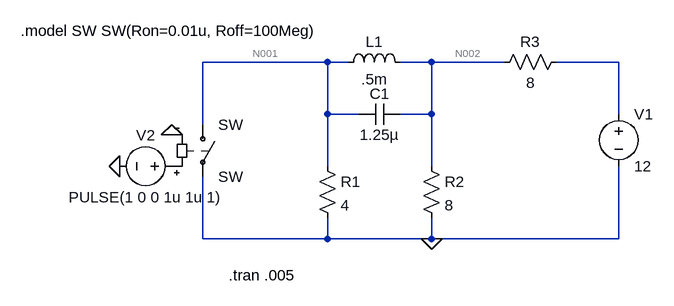
[diagram p0: schematic pas75.asc]
pas75.asc, the LTspice schematic file:
Version 4.1
SHEET 1 880 680
WIRE 32 32 -160 32
WIRE 64 32 32 32
WIRE 192 32 144 32
WIRE 304 32 192 32
WIRE 480 32 384 32
WIRE 32 112 32 32
WIRE 80 112 32 112
WIRE 192 112 192 32
WIRE 192 112 144 112
WIRE 480 112 480 32
WIRE -160 128 -160 32
WIRE 32 192 32 112
WIRE 192 192 192 112
WIRE -160 304 -160 208
WIRE 32 304 32 272
WIRE 32 304 -160 304
WIRE 192 304 192 272
WIRE 192 304 32 304
WIRE 480 304 480 192
WIRE 480 304 192 304
FLAG -288 192 0
FLAG -208 144 0
FLAG 192 304 0
SYMBOL cap 144 96 R90
WINDOW 0 0 32 VBottom 2
WINDOW 3 32 32 VTop 2
SYMATTR InstName C1
SYMATTR Value 1.25µ
SYMATTR SpiceLine Rser=0
SYMBOL ind 48 48 R270
WINDOW 0 32 56 VTop 2
WINDOW 3 5 56 VBottom 2
SYMATTR InstName L1
SYMATTR Value .5m
SYMATTR SpiceLine Rser=0
SYMBOL res 16 176 R0
SYMATTR InstName R1
SYMATTR Value 4
SYMBOL res 176 176 R0
SYMATTR InstName R2
SYMATTR Value 8
SYMBOL res 400 16 R90
WINDOW 0 0 56 VBottom 2
WINDOW 3 32 56 VTop 2
SYMATTR InstName R3
SYMATTR Value 8
SYMBOL voltage 480 96 R0
SYMATTR InstName V1
SYMATTR Value 12
SYMBOL sw -160 112 R0
SYMATTR InstName SW
SYMBOL voltage -192 192 R90
WINDOW 0 -32 56 VBottom 2
WINDOW 3 32 56 VTop 2
WINDOW 123 0 0 Left 0
WINDOW 39 0 0 Left 0
SYMATTR InstName V2
SYMATTR Value PULSE(1 0 0 1u 1u 1)
TEXT -440 -16 Left 2 !.model SW SW(Ron=0.01u, Roff=100Meg)
TEXT -120 360 Left 2 !.tran .005

The netlist it stands for:
* pas75.asc
C1 N002 N001 1.25µ Rser=0
L1 N001 N002 .5m Rser=0
R1 N001 0 4
R2 N002 0 8
R3 N003 N002 8
V1 N003 0 12
SW N001 0 P001 0 SW
V2 P001 0 PULSE(1 0 0 1u 1u 1)
.model SW SW(Ron=0.01u, Roff=100Meg)
.tran .005
.backanno
.end

* Results of the author's LTspice run, read from the files saved beside the schematic
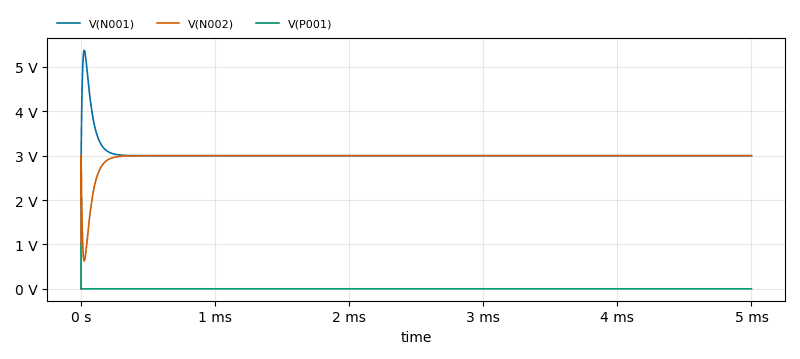
[diagram p1: Transient Analysis of pas75.asc, plotted from the saved traces]
* Transient Analysis, 1 run:
*   V(N001): min 0 V, max 5.374 V, average 3.037 V, rms 3.046 V, last 3 V
*   V(N002): min 0 V, max 3 V, average 2.962 V, rms 2.972 V, last 3 V
*   V(P001): min 0 V, max 1 V, average 100 µV, rms 10 mV, last 0 V